# Altium schematic sheet power.SchDoc
size A4
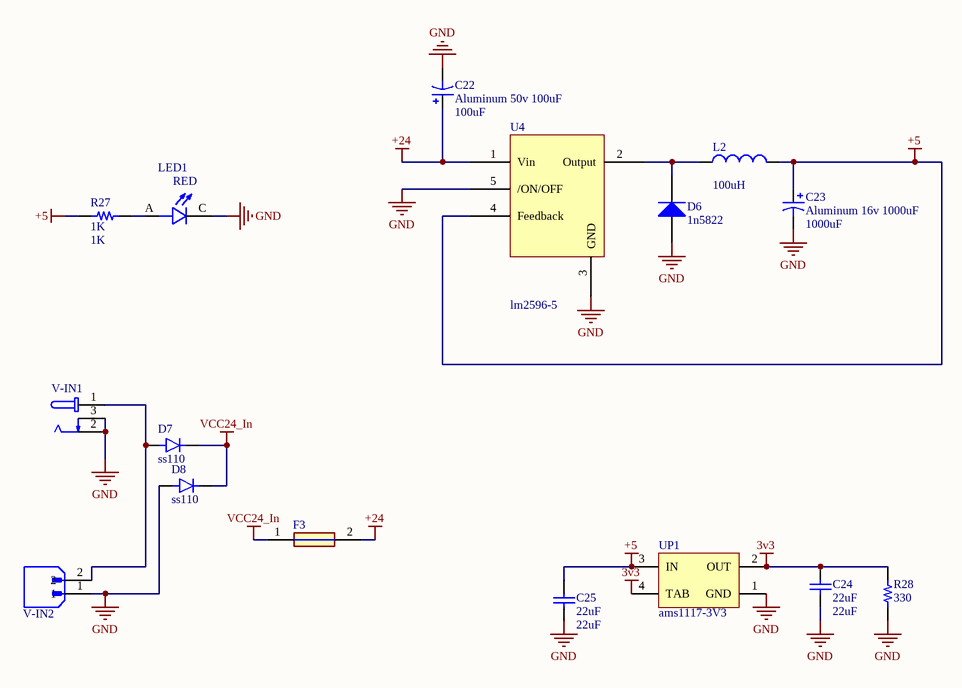
[diagram p0: power.SchDoc]

## Parts
C22  Aluminum 50v 100uF  value 100uF  [Cap SMD 100UF 35~50v]
C23  Aluminum 16v 1000uF  value 1000uF  [CAP SMD 1000UF 16V]
C24  22uF  [0603C]
C25  22uF  [0603C]
D6  1n5822  [SMA DIODE 2]
D7  ss110  [ss110]
D8  ss110  [ss110]
F3  fuse 2amp  [1206 FUSE]  (value not drawn)
L2  value 100uH  [inductor]  (hidden comment: inductor 100uH)
LED1  LED RED  [LED_7012X1]  (value not drawn)
R27  1K  [0603R]
R28  330  [0603R]
U4  lm2596-5  [2596]
UP1  ams1117-3V3  [SOT223]
V-IN1  DC jack power  [GCT_DCJ235-05-A-XX-X_REVA]  (value not drawn)
V-IN2  Phoenix  [AMPHENOL_OQ0271510000G]  (value not drawn)

## Nets
3v3: C24.2 R28.1 UP1.2(OUT) UP1.4(TAB)
+5: C23.1 C25.2 L2.2 R27.1 U4.4(Feedback) UP1.3(IN)
+24: C22.1 F3.2 U4.1(Vin)
GND: C22.2 C23.2 C24.1 C25.1 D6.1(A) D8.A LED1.C R28.2 U4.3(GND) U4.5(/ON/OFF) UP1.1(GND) V-IN1.2 V-IN1.3 V-IN2.1
VCC24_In: D7.C(K) D8.C(K) F3.1
NetD6_2: D6.2(K) L2.1 U4.2(Output)
NetD7_A: D7.A V-IN1.1 V-IN2.2
NetLED1_A: LED1.A R27.2

## Notes on the sheet
- (in symbol 7012X1) RED

## Library data of the parts
C22 C23 = Cap Pol1: CAP POLAR SMD; Published: 8-Jun-2000; LatestRevisionDate: 17-Jul-2002; LatestRevisionNote: Re-released for DXP Platform.; PackageReference: RB7.6-15; Publisher: Altium Limited; PackageDescription: Polarized Capacitor (Radial); 2 Leads
C24 C25 = Cap: CAP SMD 0603; Published: 8-Jun-2000; LatestRevisionDate: 17-Jul-2002; LatestRevisionNote: Re-released for DXP Platform.; PackageReference: RAD-0.3; Publisher: Altium Limited; PackageDescription: Radial Cap, Thru-Hole; 2 Leads; 0.3 in Pin Spacing; Value: 22uF
D6 = Diode 1N4007: 1 Amp schottky Diode SMA; Published: 8-Jun-2000; LatestRevisionDate: 17-Jul-2002; LatestRevisionNote: Re-released for DXP Platform.; DatasheetVersion: 1998; PackageVersion: Aug-1999; PackageReference: DO-41; Publisher: Altium Limited; PackageDescription: Diode, Axial; Body 5.2 x 2.7 mm (LxDia. max), Lead Dia. 0.86 mm (max); Code_JEDEC: DO-204-AL; ComponentLink1Description: Manufacturer Link; ComponentLink1URL: http://www.fairchildsemi.com/; ComponentLink2Description: Datasheet; ComponentLink2URL: http://www.fairchildsemi.com/ds/1N%2F1N4001.pdf
D7 D8 = SBR0560S1-7: Diode Super Barrier 60V 500mA Surface Mount SOD-123; MF: Diodes Inc.; MP: SBR0560S1-7; Availability: Unavailable; SnapEDA_Link: https://www.snapeda.com/parts/SBR0560S1-7/Diodes%20Inc./view-part/491648/?ref=snap; Package: SOD-123 Diodes Inc.; Value: *; Price: None
F3 = 1206SFS200F_63-2: Fuse 1206; Manufacturer_Name: TE Connectivity; Manufacturer_Part_Number: 1206SFS200F/63-2; Datasheet Link: http://docs-emea.rs-online.com/webdocs/13b6/0900766b813b6e27.pdf; Height: 1.17mm
L2 = Inductor: Inductor 12*12mm; Code_IEC: 1005; Published: 8-Jun-2000; LatestRevisionDate: 29-May-2009; LatestRevisionNote: IPC-7351 Footprint Added.; PackageReference: 0402-A; Publisher: Altium Limited; PackageDescription: Chip Inductor; Code_JEITA: 0402
LED1 = 7012X1: LED SMD 0805 RED; Package: None; Price: None; Value: *; MP: 7012X1; Availability: Unavailable
R27 R28 = Resistor: RES SMD 0603; Part Number: RCS0805100KFKEA
  R27: Value: 1K
  R28: Value: 330
U4 = lm2596
UP1 = AMS1117-x.x: 3.3 Volt, 800mA SOT-223; Designer: Ali Hafizi; Data: 16-12-2016
V-IN1 = DCJ235-05-A-XX-X_REVA: Dc Power Jack on-board; MF: Global Connector Technology; MP: DCJ235-05-A-K1-A; Price: None; Availability: Unavailable; Package: None; SnapEDA_Link: https://www.snapeda.com/parts/DCJ235-05-A-K1-A/Global%20Connector%20Technology/view-part/813042/?ref=snap; Value: *
V-IN2 = OQ0271510000G: Phoenix Terminal Right 2PIN; MF: Amphenol Anytek; MP: OQ0271510000G; Value: *; Check_prices: https://www.snapeda.com/parts/OQ0271510000G/Amphenol/view-part/4075971/?ref=eda; SnapEDA_Link: https://www.snapeda.com/parts/OQ0271510000G/Amphenol/view-part/4075971/?ref=snap; Price: None; Availability: Warning; Purchase-URL: https://pricing.snapeda.com/search/part/OQ0271510000G/?ref=eda; Package: None